# Altium schematic sheet Vertical.SchDoc
size Letter; Organization: Ploopy Co; Address1: 137-1140 Burnhamthorpe Road W; Address3: Ontario; DocumentNumber: 1; Revision: R1.003; SheetNumber: 1; SheetTotal: 5
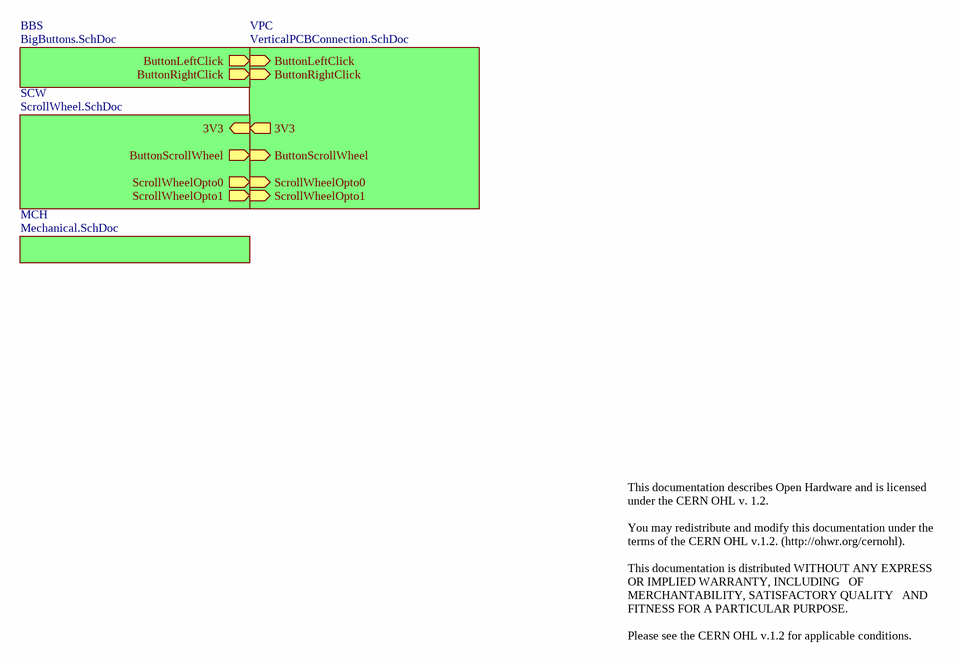
[diagram p0: Vertical.SchDoc]

## Sub-sheets
BBS = BigButtons.SchDoc: ButtonRightClick (out), ButtonLeftClick (out)
MCH = Mechanical.SchDoc: no entries
SCW = ScrollWheel.SchDoc: 3V3 (in), ScrollWheelOpto1 (out), ScrollWheelOpto0 (out), ButtonScrollWheel (out)
VPC = VerticalPCBConnection.SchDoc: 3V3 (out), ButtonRightClick (in), ButtonLeftClick (in), ScrollWheelOpto1 (in), ScrollWheelOpto0 (in), ButtonScrollWheel (in)

## Nets
(unnamed): sheet VPC/3V3, sheet SCW/3V3
(unnamed): sheet VPC/ButtonRightClick, sheet BBS/ButtonRightClick
(unnamed): sheet VPC/ButtonLeftClick, sheet BBS/ButtonLeftClick
(unnamed): sheet VPC/ScrollWheelOpto1, sheet SCW/ScrollWheelOpto1
(unnamed): sheet VPC/ScrollWheelOpto0, sheet SCW/ScrollWheelOpto0
(unnamed): sheet VPC/ButtonScrollWheel, sheet SCW/ButtonScrollWheel

## Notes on the sheet
- This documentation describes Open Hardware and is licensed under the CERN OHL v. 1.2.
  You may redistribute and modify this documentation under the terms of the CERN OHL v.1.2. (http://ohwr.org/cernohl).
  This documentation is distributed WITHOUT ANY EXPRESS OR IMPLIED WARRANTY, INCLUDING   OF MERCHANTABILITY, SATISFACTORY QUALITY   AND FITNESS FOR A PARTICULAR PURPOSE.
  Please see the CERN OHL v.1.2 for applicable conditions.
- Copyright Ploopy Corporation 2019
- Licensed under the CERN OHL v. 1.2
- http://ohwr.org/cernohl
- Title:
- PCB:
- Version:
- Ploopy Corporation
- Mississauga ON L5C 0A3
- 137-1140 Burnhamthorpe Road W
- Date:
- Time:
- Sheet
- of
- Canada